# EAGLE design eCog112_Motor (EAGLE 6.6.0)
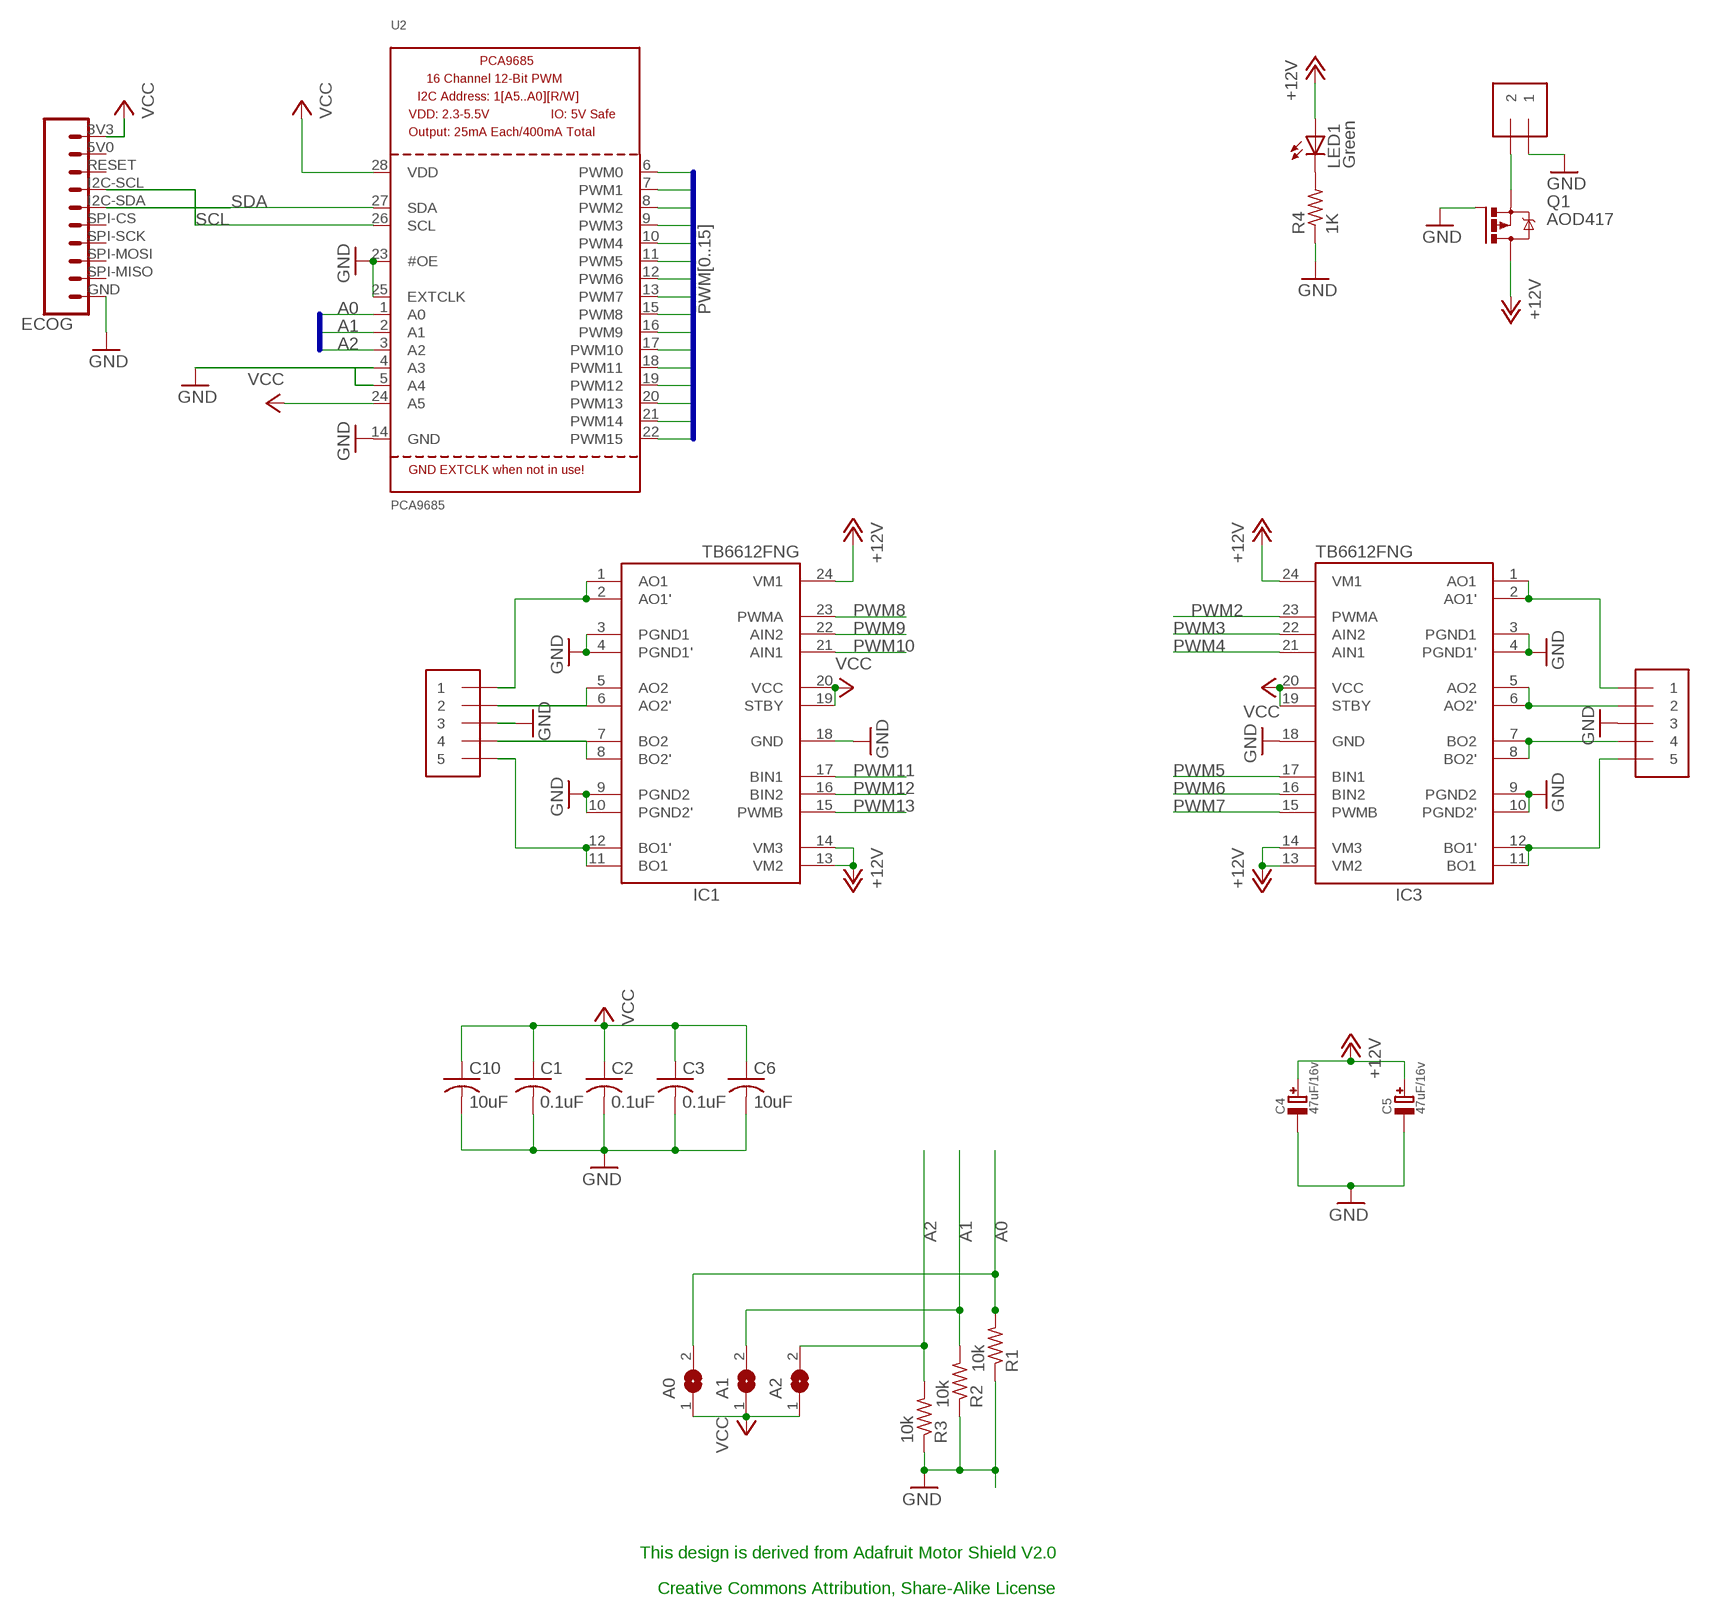
[diagram p0: schematic, sheet 1]

## Parts
A0  SJ  [SJ]
A1  SJ  [SJ]
A2  SJ  [SJ]
C1  0.1uF  C-USC0603  [C0603]
C2  0.1uF  C-USC0603  [C0603]
C3  0.1uF  C-USC0603  [C0603]
C4  47uF/16v  CAP_ELECTROLYTICPANASONIC_C  [PANASONIC_C]
C5  47uF/16v  CAP_ELECTROLYTICPANASONIC_C  [PANASONIC_C]
C6  10uF  C-USC0603  [C0603]
C10  10uF  C-USC0603  [C0603]
ECOG  ECOG_BUSES_ROWECOG_BUSES_SMD  [ECOG_BUSES_SMD]
IC1  TB6612FNG  [SSOP24]
IC3  TB6612FNG  [SSOP24]
J1  1X5  [1X05-3.5MM]
J2  1X5  [1X05-3.5MM]
LED1  Green  LEDCHIP-LED0805  [CHIP-LED0805]
MPOWER  1X2-3.5MM  [1X2-3.5MM]
Q1  AOD417  IRFR5305  [D-PAK_TO252AA]
R1  10k  R-US_R0805  [R0805]
R2  10k  R-US_R0805  [R0805]
R3  10k  R-US_R0805  [R0805]
R4  1K  R-US_R0603  [R0603]
U2  PCA9685  [TSSOP28]

## Nets
3V3: A0.1 A1.1 A2.1 C1.1 C2.1 C3.1 C6.1 C10.1 ECOG.3V3 IC1.19(STBY) IC1.20(VCC) IC3.19(STBY) IC3.20(VCC) U2.24(A5) U2.28(VDD) ; supply symbol labelled VCC
+12V: C4.+ C5.+ IC1.13(VM2) IC1.14(VM3) IC1.24(VM1) IC3.13(VM2) IC3.14(VM3) IC3.24(VM1) LED1.A Q1.4(D)
A0: A0.2 R1.2 U2.1(A0)
A1: A1.2 R2.2 U2.2(A1)
A2: A2.2 R3.2 U2.3(A2)
GND: C1.2 C2.2 C3.2 C4.- C5.- C6.2 C10.2 ECOG.GND IC1.3(PGND1) IC1.4(PGND1') IC1.9(PGND2) IC1.10(PGND2') IC1.18(GND) IC3.3(PGND1) IC3.4(PGND1') IC3.9(PGND2) IC3.10(PGND2') IC3.18(GND) J1.3 J2.3 MPOWER.1 Q1.1(G) R1.1 R2.1 R3.1 R4.1 U2.4(A3) U2.5(A4) U2.14(GND) U2.23(#OE) U2.25(EXTCLK)
N$4: IC1.1(AO1) IC1.2(AO1') J1.1
N$6: IC1.5(AO2) IC1.6(AO2') J1.2
N$7: IC1.7(BO2) IC1.8(BO2') J1.4
N$9: IC1.11(BO1) IC1.12(BO1') J1.5
N$12: IC3.1(AO1) IC3.2(AO1') J2.1
N$14: IC3.5(AO2) IC3.6(AO2') J2.2
N$15: IC3.7(BO2) IC3.8(BO2') J2.4
N$17: IC3.11(BO1) IC3.12(BO1') J2.5
N$133: LED1.C R4.2
N$140: MPOWER.2 Q1.3(S)
PWM0: U2.6(PWM0)
PWM1: U2.7(PWM1)
PWM2: IC3.23(PWMA) U2.8(PWM2)
PWM3: IC3.22(AIN2) U2.9(PWM3)
PWM4: IC3.21(AIN1) U2.10(PWM4)
PWM5: IC3.17(BIN1) U2.11(PWM5)
PWM6: IC3.16(BIN2) U2.12(PWM6)
PWM7: IC3.15(PWMB) U2.13(PWM7)
PWM8: IC1.23(PWMA) U2.15(PWM8)
PWM9: IC1.22(AIN2) U2.16(PWM9)
PWM10: IC1.21(AIN1) U2.17(PWM10)
PWM11: IC1.17(BIN1) U2.18(PWM11)
PWM12: IC1.16(BIN2) U2.19(PWM12)
PWM13: IC1.15(PWMB) U2.20(PWM13)
PWM14: U2.21(PWM14)
PWM15: U2.22(PWM15)
SCL: ECOG.I2C-SCL U2.26(SCL)
SDA: ECOG.I2C-SDA U2.27(SDA)
Unconnected: ECOG.5V0 ECOG.RESET ECOG.SPI-CS ECOG.SPI-MISO ECOG.SPI-MOSI ECOG.SPI-SCK

## Buses
PWM[0..15]
A[0..4]

## Notes on the sheet
- This design is derived from Adafruit Motor Shield V2.0
- Creative Commons Attribution, Share-Alike License

## Library data of the parts
A0 A1 A2 = jumper:SJ: SMD solder JUMPER; BOM: EXCLUDE
C1-C3 = adafruit:C-US: CAPACITOR, American symbol; PARTNO: GRM188F51E104ZA01D,MURATA ELECTRONICS (VA),DK,490-1575-1-ND,CAP CER .1UF 25V Y5V 0603, REF2
C4 C5 = microbuilder:CAP_ELECTROLYTIC: Electrolytic Capacitors SMT PANASONIC_C - Size C Panasonic Electrolytic Aluminum Capacitor 47µF 16V 20% Electrolytic Capacitor [Digikey: PCE3890TR-ND] PANASONIC_D - Size D Panasonic Electrolytic Aluminum Capacitor 100µF 25V 20% Electrolytic Capacitor [Digikey: PCE3898TR-ND] PTH 3.5 mm grid, 8 mm diameter ... 3.5 mm grid, 10 mm diameter ...; DIGIKEY: PCE3890CT-ND; PARTNO: EEE-1CA470WR,panasonic,dk,PCE3890CT-ND ,CAP ALUM 47UF 20% 16V SMD , REF79
C6 C10 = adafruit:C-US: CAPACITOR, American symbol; PARTNO: GRM188R60G106ME47D,MURATA ELECTRONICS (VA),dk,490-3298-1-ND,CAP CER 10UF 4V X5R 0603 , REF83
ECOG = eCogs:ECOG_BUSES_ROW; DIGIKEY: S1013EC-10-ND; PARTNO: NREC010SABC-M30RC,SULLINS CONNECTOR SOLUTIONS,dk,S1013EC-10-ND,10 Positions Header Unshrouded Connector 0.100 (2.54mm) Surface Mount Tin eCog, REF78
IC1 IC3 = adafruit:TB6612FNG: TB6612FNG MOS dual H-bridge motor driver, 1.2A current 3.2A peak 3 or 5v logic and 3-15v motor; PARTNO: TB6612FNGC8EL,Toshiba,dk,TB6612FNGC8ELCT-ND,IC MOTOR DRIVER PAR 24SSOP , REF80
J1 J2 = adafruit:1X5; PARTNO: 1984646,Pheonix Contact,dk,277-1723-ND,CONN TERM BLOCK T/H 5POS 3.5MM , REF84
LED1 = adafruit:LED: LED OSRAM: - CHIPLED LG R971, LG N971, LY N971, LG Q971, LY Q971, LO R971, LY R971 LH N974, LH R974 LS Q976, LO Q976, LY Q976 LO Q996 - Hyper CHIPLED LW Q18S LB Q993, LB Q99A, LB R99A - SideLED LS A670, LO A670, LY A670, LG A670, LP A670 LB A673, LV A673, LT A673, LW A673 LH A674 LY A675 LS A676, LA A676, LO A676, LY A676, LW A676 LS A679, LY A679, LG A679 - Hyper Micro SIDELED® LS Y876, LA Y876, LO Y876, LY Y876 LT Y87S - SmartLED LW L88C, LW L88S LB L89C, LB L89S, LG L890 LS L89K, LO L89K, LY L89K LS L896, LA L896, LO L896, LY L896 - TOPLED LS T670, LO T670, LY T670, LG T670, LP T670 LSG T670, LSP T670, LSY T670, LOP T670, LYG T670 LG T671, LOG T671, LSG T671 LB T673, LV T673, LT T673, LW T673 LH T674 LS T676, LA T676, LO T676, LY T676, LB T676, LH T676, LSB T676, LW T676 LB T67C, LV T67C, LT T67C, LS T67K, LO T67K, LY T67K, LW E67C LS E67B, LA E67B, LO E67B, LY E67B, LB E67C, LV E67C, LT E67C LW T67C LS T679, LY T679, LG T679 LS T770, LO T770, LY T770, LG T770, LP T770 LB T773, LV T773, LT T773, LW T773 LH T774 LS E675, LA E675, LY E675, LS T675 LS T776, LA T776, LO T776, LY T776, LB T776 LHGB T686 LT T68C, LB T68C - Hyper Mini TOPLED® LB M676 - Mini TOPLED Santana® LG M470 LS M47K, LO M47K, LY M47K Source: http://www.osram.convergy.de/; PARTNO: LTST-C170KGKT,LITE-ON INC (VA),DK,160-1414-1-ND,LED GREEN CLEAR 0805 SMD, REF17
MPOWER = adafruit:1X2: 3.5mm Terminal block http://www.ladyada.net/library/pcb/eaglelibrary.html; PARTNO: 1984617,Pheonix Contact,dk,277-1721-ND,CONN TERM BLOCK T/H 2POS 3.5MM , REF85
Q1 = transistor-power:IRF?5305: HEXFET Power MOSFET Source: http://www.irf.com/product-info/datasheets/data/irfr5305pbf.pdf; PARTNO: AOD417,Alpha & Omega Semiconductor Inc.,dk,785-1106-1-ND,MOSFET P-CH 30V 25A TO252 , REF82
R1-R3 = adafruit:R-US_: RESISTOR, American symbol; PARTNO: RC0805JR-0710KL,YAGEO (VA),dk,311-10KARCT-ND,RES SMD 10K OHM 5% 1/8W 0805, REF63
R4 = adafruit:R-US_: RESISTOR, American symbol; PARTNO: RC0603JR-071KL,YAGEO (VA),dk,311-1.0KGRTR-ND,RES SMD 1K OHM 5% 1/10W 0603 , REF73
U2 = microbuilder:PCA9685: PCA9685 - 16 Channel 12-Bit I2C PWM Controller 5.0V tolerant 16 channel, 12-bit I2C PWM controller with 25mA per output (max. 400mA total) Digikey: 568-5931-1-ND; PARTNO: PCA9685PWQ900118,NXP,dk,568-5931-1-ND,LED Driver IC 16 Output Linear PWM Dimming 25mA 28-TSSOP , REF81

## Board
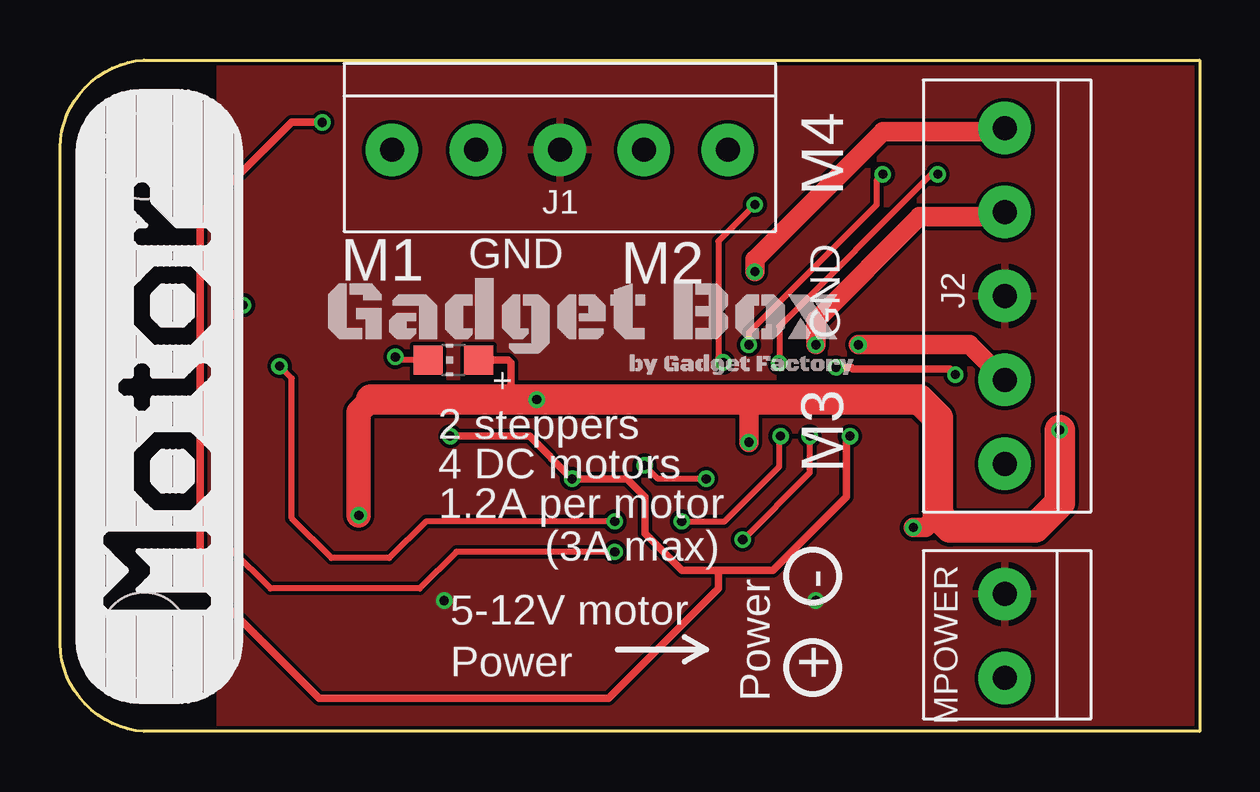
[diagram p1: board, top side]
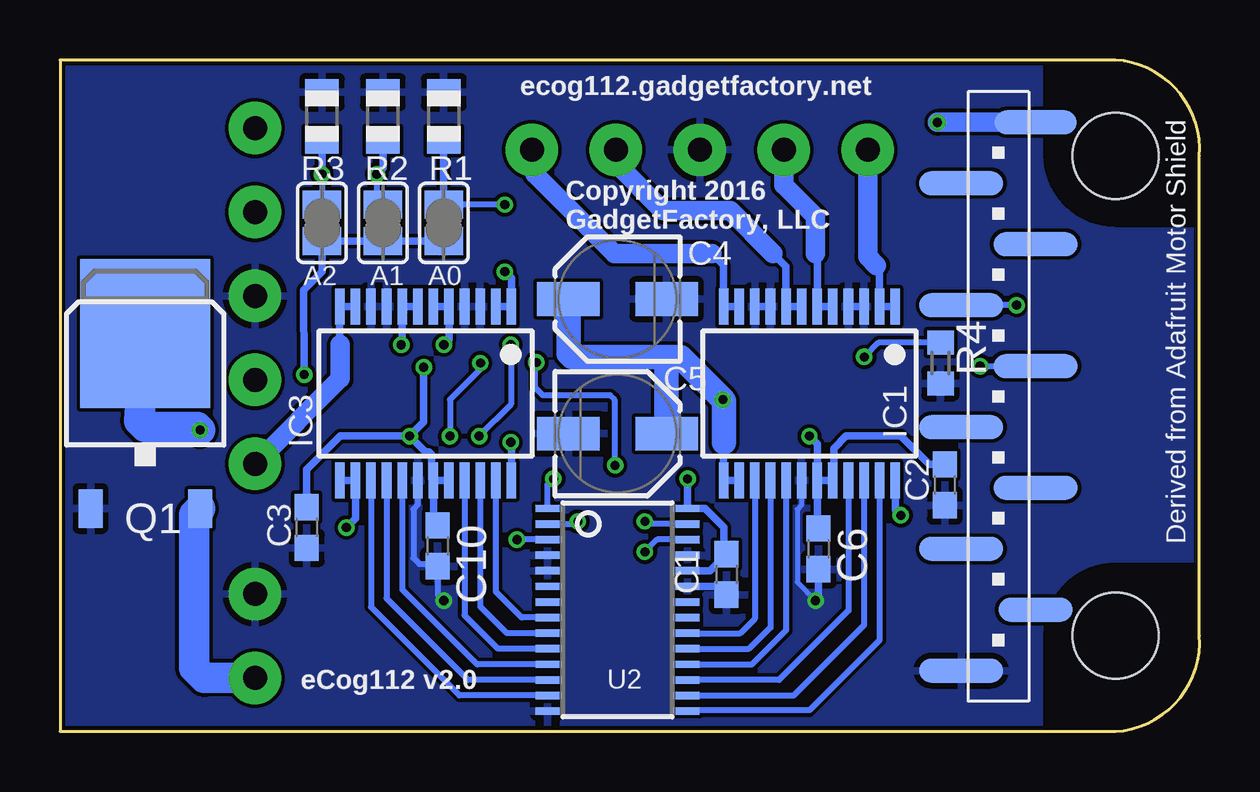
[diagram p2: board, bottom side, seen from below]

Size 47.51 x 28 mm. Coordinates in mm from the lower left corner, seen from the top.
Copper layers (1*16): Top 0.035mm / dielectric 1.5mm / Bottom 0.035mm
Design rules "hackvana": minimum track width 6mil, minimum drill 0.3mm, track to track 6mil, track to pad 6mil, pad to pad 6mil, via to via 6mil, smd to smd 0mil, copper to edge 6mil, drill to drill 6mil, minimum pad ring 10mil, minimum via ring 6mil, stop-mask expansion 2mil, vias tented up to drill 100mil, thermal gap 10mil

### Footprints (pad centres in the part's own frame; a part is rotated, then mirrored left to right if it is on the bottom)
SJ = smd 1.168 x 1.6: 1 -0.762,0; 2 0.762,0
C0603 = smd 1.1 x 1: 1 -0.85,0; 2 0.85,0
PANASONIC_C = smd 2.6 x 1.4: + 2.05,0; - -2.05,0
ECOG_BUSES_SMD = smd 3.4 x 1 bottom: 3V3 7.337,25.4 | smd 3.5 x 1 bottom: 5V0 10.436,22.86; GND 10.436,2.54; I2C-SCL 10.436,17.78; I2C-SDA 7.337,15.24; RESET 7.337,20.32; SPI-CS 10.436,12.7; SPI-MOSI 10.436,7.62; SPI-SCK 7.337,10.16 | smd 3.1 x 1 bottom: SPI-MISO 7.337,5.08 | hole 3.6: 4.004,24.003; 4.004,4.003
SSOP24 = smd 0.4 x 1.5: 1 -3.575,-3.625; 2 -2.925,-3.625; 3 -2.275,-3.625; 4 -1.625,-3.625; 5 -0.975,-3.625; 6 -0.325,-3.625; 7 0.325,-3.625; 8 0.975,-3.625; 9 1.625,-3.625; 10 2.275,-3.625; 11 2.925,-3.625; 12 3.575,-3.625; 13 3.575,3.625; 14 2.925,3.625; 15 2.275,3.625; 16 1.625,3.625; 17 0.975,3.625; 18 0.325,3.625; 19 -0.325,3.625; 20 -0.975,3.625; 21 -1.625,3.625; 22 -2.275,3.625; 23 -2.925,3.625; 24 -3.575,3.625
1X05-3.5MM = drill 1 pad 2.184: 1 7,0; 2 3.5,0; 3 0,0; 4 -3.5,0; 5 -7,0
CHIP-LED0805 = smd 1.2 x 1.2: A 0,-1.05; C 0,1.05
1X2-3.5MM = drill 1 pad 2.184: 1 1.8,0; 2 -1.7,0
D-PAK_TO252AA = smd 1 x 1.6: 1 -2.28,-4.8; 3 2.28,-4.8 | smd 5.4 x 6.2: 4 0,2.5
R0805 = smd 1.1 x 1.4: 1 -1,0; 2 1,0
R0603 = smd 1 x 1.1: 1 -0.85,0; 2 0.85,0
TSSOP28 = smd 0.305 x 0.991: 1 -4.225,-2.918; 2 -3.575,-2.918; 3 -2.925,-2.918; 4 -2.275,-2.918; 5 -1.625,-2.918; 6 -0.975,-2.918; 7 -0.325,-2.918; 8 0.325,-2.918; 9 0.975,-2.918; 10 1.625,-2.918; 11 2.275,-2.918; 12 2.925,-2.918; 13 3.575,-2.918; 14 4.225,-2.918; 15 4.225,2.918; 16 3.575,2.918; 17 2.925,2.918; 18 2.275,2.918; 19 1.625,2.918; 20 0.975,2.918; 21 0.325,2.918; 22 -0.325,2.918; 23 -0.975,2.918; 24 -1.625,2.918; 25 -2.275,2.918; 26 -2.925,2.918; 27 -3.575,2.918; 28 -4.225,2.918

### Placement (x,y rotation side)
A0  31.51,21.21 90 bottom
A1  34.05,21.21 90 bottom
A2  36.59,21.21 90 bottom
C1  19.72,6.55 270 bottom
C2  10.63,10.28 270 bottom
C3  37.22,8.51 270 bottom
C4  24.27,18.03 180 bottom
C5  24.27,12.42 0 bottom
C6  15.89,7.62 270 bottom
C10  31.76,7.74 270 bottom
ECOG  -0.5,0 0 top
IC1  16.27,14.09 180 bottom
IC3  32.27,14.09 180 bottom
J1  20.84,24.25 180 top
J2  39.38,18.16 90 top
LED1  16.39,15.49 90 top
MPOWER  39.38,3.93 90 top
Q1  43.95,14.09 0 bottom
R1  31.51,25.65 270 bottom
R2  34.05,25.65 270 bottom
R3  36.59,25.65 270 bottom
R4  10.81,15.36 90 bottom
U2  24.27,5.08 270 bottom
U$2  [GADGETBOX_SMALL]  21.86,17.27 0 top

### Tracks (layer width: path | path; a pad name or v marks a point on that pad's centre or on a via)
3V3  (via drill 0.38)
  Top 0.305: 16.52,12.32 v16.27,12.32 19.57,12.32 v21.35,10.54 23.63,10.54 24.4,9.78 24.4,8.25 25.92,6.73 27.44,6.73 | 27.44,6.73 29.73,6.73 32.78,9.78 32.78,12.42 v32.93,12.32 | 27.44,6.73 27.44,5.97 22.87,1.39 10.81,1.39 5.85,6.35 5.85,21.59 9.66,25.4 v10.93,25.4 | v32.35,15.19 32.98,15.19 33.06,15.11 37.1,15.11 v37.32,14.88
  Bottom 0.305: IC1.19 IC1.20 15.25,10.51 15.25,11.81 14.74,12.32 12.46,12.32 11.28,11.13 C2.1 | IC1.19 15.94,8.52 C6.1 | U2.24 20.42,6.7 C1.1 19.82,7.5 19.82,8.51 20.62,9.3 U2.28 v21.35,10.54 | IC3.20 IC3.19 | IC3.19 32.02,10.54 32.02,11.55 32.12,11.66 32.27,11.66 v32.93,12.32 | IC1.19 15.94,11.99 v16.27,12.32 | A0.1 A1.1 A2.1 36.59,19.17 37.35,18.41 v37.32,14.88 | IC3.19 31.94,8.78 C10.1 | v32.35,15.19 32.35,12.9 v32.93,12.32 | C3.1 37.22,10.92 35.83,12.32 v32.93,12.32
  Bottom 0.813: ECOG.3V3 v10.93,25.4
+12V  (via drill 0.38)
  Top 0.305: LED1.A 18.68,15.49 18.81,15.36 18.81,14.09 18.55,13.84
  Top 0.813: v28.71,12.06 28.71,13.84 | v35.57,8.51 36.08,8.51 36.59,9.01
  Top 1.016: v12.46,9.01 12.46,13.33 12.97,13.84
  Top 1.27: v41.67,12.57 41.67,9.52 40.65,8.51 37.1,8.51 36.59,9.01 36.59,13.08 35.83,13.84 28.71,13.84 v19.87,13.84 18.55,13.84 12.97,13.84
  Bottom 0.305: IC1.24 12.69,9.25 v12.46,9.01 | 19.82,12.06 19.84,12.04 IC1.13 IC1.14 | IC3.24 28.69,12.04 v28.71,12.06 | IC3.13 IC3.14 35.19,8.88 v35.57,8.51
  Bottom 1.016: 19.82,12.06 19.82,13.79 v19.87,13.84 21.65,15.62 22.36,15.62 | C4.+ 26.32,15.76 26.17,15.62 22.36,15.62 | C5.+ 22.22,15.47 22.36,15.62
  Bottom 1.27: Q1.4 44.21,12.95 43.95,12.7 41.79,12.7 v41.67,12.57
A0  (via drill 0.38)
  Top 0.254: v28.97,21.97 27.44,20.44 27.44,15.59 v27.65,15.39 | v26.94,10.54 24.93,10.54 v24.37,11.1
  Bottom 0.254: v28.97,21.97 A0.2 | v27.65,15.39 27.7,15.34 27.7,14.35 27.37,14.02 24.57,14.02 24.4,13.84 24.4,11.12 v24.37,11.1 | U2.1 27.19,10.29 v26.94,10.54
  Bottom 0.305: R1.2 A0.2
A1  (via drill 0.38)
  Top 0.254: v25.92,8.76 27.7,8.76 29.98,11.05 29.98,12.27 v30.03,12.32 | v28.71,16.13 28.71,16.63 A1.2 34.05,22.98 v34.3,23.24
  Bottom 0.254: U2.2 26.03,8.65 v25.92,8.76 | v34.3,23.24 34.3,22.22 A1.2 | v28.71,16.13 28.71,13.64 v30.03,12.32
  Bottom 0.305: R2.2 34.05,23.49 v34.3,23.24
A2  (via drill 0.38)
  Top 0.254: v36.59,23.24 36.33,23.24 29.98,16.89 v29.98,15.36 | v28.46,8 31.25,10.79 v31.25,12.32
  Bottom 0.254: U2.3 v28.46,8 | v36.59,23.24 A2.2 | v29.98,15.36 29.98,15.11 31.25,13.84 v31.25,12.32
  Bottom 0.305: R3.2 v36.59,23.24
GND  (via drill 0.38)
  Top 0.305: v16.01,5.46 16.27,5.46
  Bottom 0.203: IC1.18 16.59,9.45 16.78,9.27 16.78,6.22 v16.01,5.46
  Bottom 0.254: IC3.18 32.59,9.45 32.78,9.27 32.78,7.24 32.52,6.98 31.85,6.98 C10.2 31.76,5.71 v31.51,5.46
  Bottom 0.305: IC1.3 IC1.4 | IC1.10 IC1.9 | U2.23 20.07,6.05 C1.2 | C6.2 15.89,5.58 v16.01,5.46
  pour Bottom: -3.04,-2.42 -3.04,30.6 50.43,30.48 50.43,-2.54
  pour Top: -1.77,-1.15 -1.77,29.08 48.65,29.08 48.65,-1.15
N$4
  Bottom 0.305: IC1.1 IC1.2 13.34,19.3 13.47,19.43
  Bottom 0.813: J1.1 13.84,19.79 13.47,19.43
N$6
  Bottom 0.305: IC1.5 IC1.6 15.94,19.86 16.01,19.94
  Bottom 0.813: J1.2 17.34,22.79 16.01,21.46 16.01,19.94
N$7
  Bottom 0.305: IC1.7 IC1.8 17.24,19.39 17.79,19.94
  Bottom 0.813: J1.4 24.34,23.69 22.36,21.71 19.57,21.71 17.79,19.94
N$9
  Bottom 0.305: IC1.11 IC1.12 19.84,19.45 20.33,19.94
  Bottom 0.813: 20.33,19.94 24.4,19.94 27.7,23.24 27.7,24.11 J1.5
N$12  (via drill 0.38)
  Top 0.813: v28.97,19.17 28.97,19.68 34.3,25.02 39.24,25.02 J2.1
  Bottom 0.305: IC3.2 IC3.1 28.69,18.9 v28.97,19.17
N$14  (via drill 0.38)
  Top 0.813: v31.51,16.13 31.51,17.14 35.83,21.46 39.18,21.46 J2.2
  Bottom 0.305: IC3.6 IC3.5 31.29,16.34 v31.51,16.13
N$15  (via drill 0.38)
  Top 0.813: v33.29,16.13 37.91,16.13 J2.4
  Bottom 0.305: IC3.7 IC3.8 33.24,16.17 v33.29,16.13
N$17
  Bottom 0.305: IC3.11 IC3.12 35.84,16.14 35.83,16.13
  Bottom 0.813: 35.83,16.13 35.83,14.71 J2.5
N$133  (via drill 0.38)
  Top 0.254: LED1.C 14.11,15.49 v13.98,15.62
  Bottom 0.254: R4.2 13.39,16.21 v13.98,15.62
N$140
  Bottom 1.27: MPOWER.2 41.49,2.23 41.92,2.66 41.92,9.05 Q1.3
PWM2
  Bottom 0.254: IC3.23 29.34,5.83 28.26,4.75 U2.8
PWM3
  Bottom 0.254: IC3.22 29.99,5.21 28.88,4.1 U2.9
PWM4
  Bottom 0.254: IC3.21 30.64,4.85 29.25,3.45 U2.10
PWM5
  Bottom 0.254: IC3.17 33.24,5.93 30.12,2.8 U2.11
PWM6
  Bottom 0.254: IC3.16 33.89,5.56 30.49,2.15 U2.12
PWM7
  Bottom 0.254: IC3.15 34.54,5.19 30.85,1.5 U2.13
PWM8
  Bottom 0.254: IC1.23 13.34,3.81 16.27,0.89 21.32,0.89 U2.15
PWM9
  Bottom 0.254: U2.16 16.92,1.5 13.98,4.44 13.98,10.46 IC1.22
PWM10
  Bottom 0.254: IC1.21 14.64,5.05 17.54,2.16 U2.17
PWM11
  Bottom 0.254: U2.18 18.67,2.8 17.24,4.23 IC1.17
PWM12
  Bottom 0.254: U2.19 18.78,3.45 17.89,4.34 IC1.16
PWM13
  Bottom 0.254: U2.20 19.15,4.1 18.54,4.71 IC1.15
SCL  (via drill 0.38)
  Top 0.254: v23.13,7.49 16.52,7.49 15,5.97 8.77,5.97 7.12,7.62 7.12,17.27 v7.63,17.78
  Bottom 0.254: U2.26 22.61,8 v23.13,7.49 | v7.63,17.78 ECOG.I2C-SCL
SDA  (via drill 0.38)
  Top 0.254: v23.13,8.76 15.25,8.76 13.73,7.24 11.31,7.24 9.66,8.89 9.66,14.73 v9.16,15.24
  Bottom 0.254: U2.27 23.02,8.65 v23.13,8.76 | v9.16,15.24 ECOG.I2C-SDA

### Text on the board
tPlace: M4 | M1 | GND | M2 | GND | 2 steppers | 4 DC motors | M3 | 1.2A per motor | (3A max) | - | 5-12V motor | Power | + | Power
bPlace: ecog112.gadgetfactory.net | Derived from Adafruit Motor Shield | Copyright 2016 / GadgetFactory, LLC | eCog112 v2.0